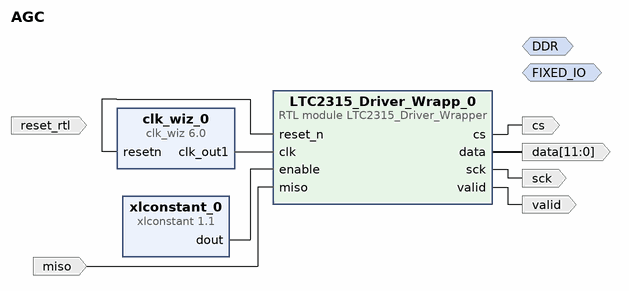
[diagram p0: block diagram of the top level]
# Vivado block design AGC, xc7z020clg400-1, Vivado 2023.2
create_bd_design AGC

create_bd_intf_port -mode Master -vlnv xilinx.com:interface:ddrx_rtl:1.0 DDR
create_bd_intf_port -mode Master -vlnv xilinx.com:display_processing_system7:fixedio_rtl:1.0 FIXED_IO
create_bd_port -dir O -from 11 -to 0 -type data data
create_bd_port -dir O -type clk sck
create_bd_port -dir I miso
create_bd_port -dir O cs
create_bd_port -dir O valid
create_bd_port -dir I -type rst reset_rtl
set_property -dict {CONFIG.POLARITY ACTIVE_LOW} [get_bd_ports reset_rtl]

create_bd_cell -type module -reference LTC2315_Driver_Wrapper LTC2315_Driver_Wrapp_0
create_bd_cell -type ip -vlnv xilinx.com:ip:clk_wiz:6.0 clk_wiz_0
set_property -dict [list \
  CONFIG.CLKIN1_JITTER_PS 200.0 \
  CONFIG.CLKOUT1_DRIVES BUFG \
  CONFIG.CLKOUT1_JITTER 257.981 \
  CONFIG.CLKOUT1_PHASE_ERROR 254.101 \
  CONFIG.CLKOUT1_REQUESTED_OUT_FREQ 87.5 \
  CONFIG.CLKOUT2_DRIVES BUFG \
  CONFIG.CLKOUT3_DRIVES BUFG \
  CONFIG.CLKOUT4_DRIVES BUFG \
  CONFIG.CLKOUT5_DRIVES BUFG \
  CONFIG.CLKOUT6_DRIVES BUFG \
  CONFIG.CLKOUT7_DRIVES BUFG \
  CONFIG.MMCM_BANDWIDTH OPTIMIZED \
  CONFIG.MMCM_CLKFBOUT_MULT_F 35 \
  CONFIG.MMCM_CLKIN1_PERIOD 20.000 \
  CONFIG.MMCM_CLKIN2_PERIOD 10.0 \
  CONFIG.MMCM_CLKOUT0_DIVIDE_F 10 \
  CONFIG.MMCM_COMPENSATION ZHOLD \
  CONFIG.MMCM_DIVCLK_DIVIDE 2 \
  CONFIG.PRIMITIVE PLL \
  CONFIG.RESET_PORT resetn \
  CONFIG.RESET_TYPE ACTIVE_LOW \
  CONFIG.SECONDARY_SOURCE Single_ended_clock_capable_pin \
  CONFIG.USE_BOARD_FLOW true \
  CONFIG.USE_INCLK_SWITCHOVER false \
] [get_bd_cells clk_wiz_0]
create_bd_cell -type ip -vlnv xilinx.com:ip:xlconstant:1.1 xlconstant_0

# ---- connections ----

connect_bd_net [get_bd_pins LTC2315_Driver_Wrapp_0/cs] [get_bd_ports cs]
connect_bd_net [get_bd_pins LTC2315_Driver_Wrapp_0/data] [get_bd_ports data]
connect_bd_net [get_bd_pins LTC2315_Driver_Wrapp_0/sck] [get_bd_ports sck]
connect_bd_net [get_bd_pins LTC2315_Driver_Wrapp_0/valid] [get_bd_ports valid]
connect_bd_net [get_bd_pins clk_wiz_0/clk_out1] [get_bd_pins LTC2315_Driver_Wrapp_0/clk]
connect_bd_net [get_bd_ports miso] [get_bd_pins LTC2315_Driver_Wrapp_0/miso]
connect_bd_net -net proc_sys_reset_0_peripheral_aresetn [get_bd_pins LTC2315_Driver_Wrapp_0/reset_n] [get_bd_pins clk_wiz_0/resetn]
connect_bd_net [get_bd_pins xlconstant_0/dout] [get_bd_pins LTC2315_Driver_Wrapp_0/enable]

validate_bd_design
save_bd_design
